# Altium schematic sheet Sheet_1.schdoc
size 604 x 406 mm
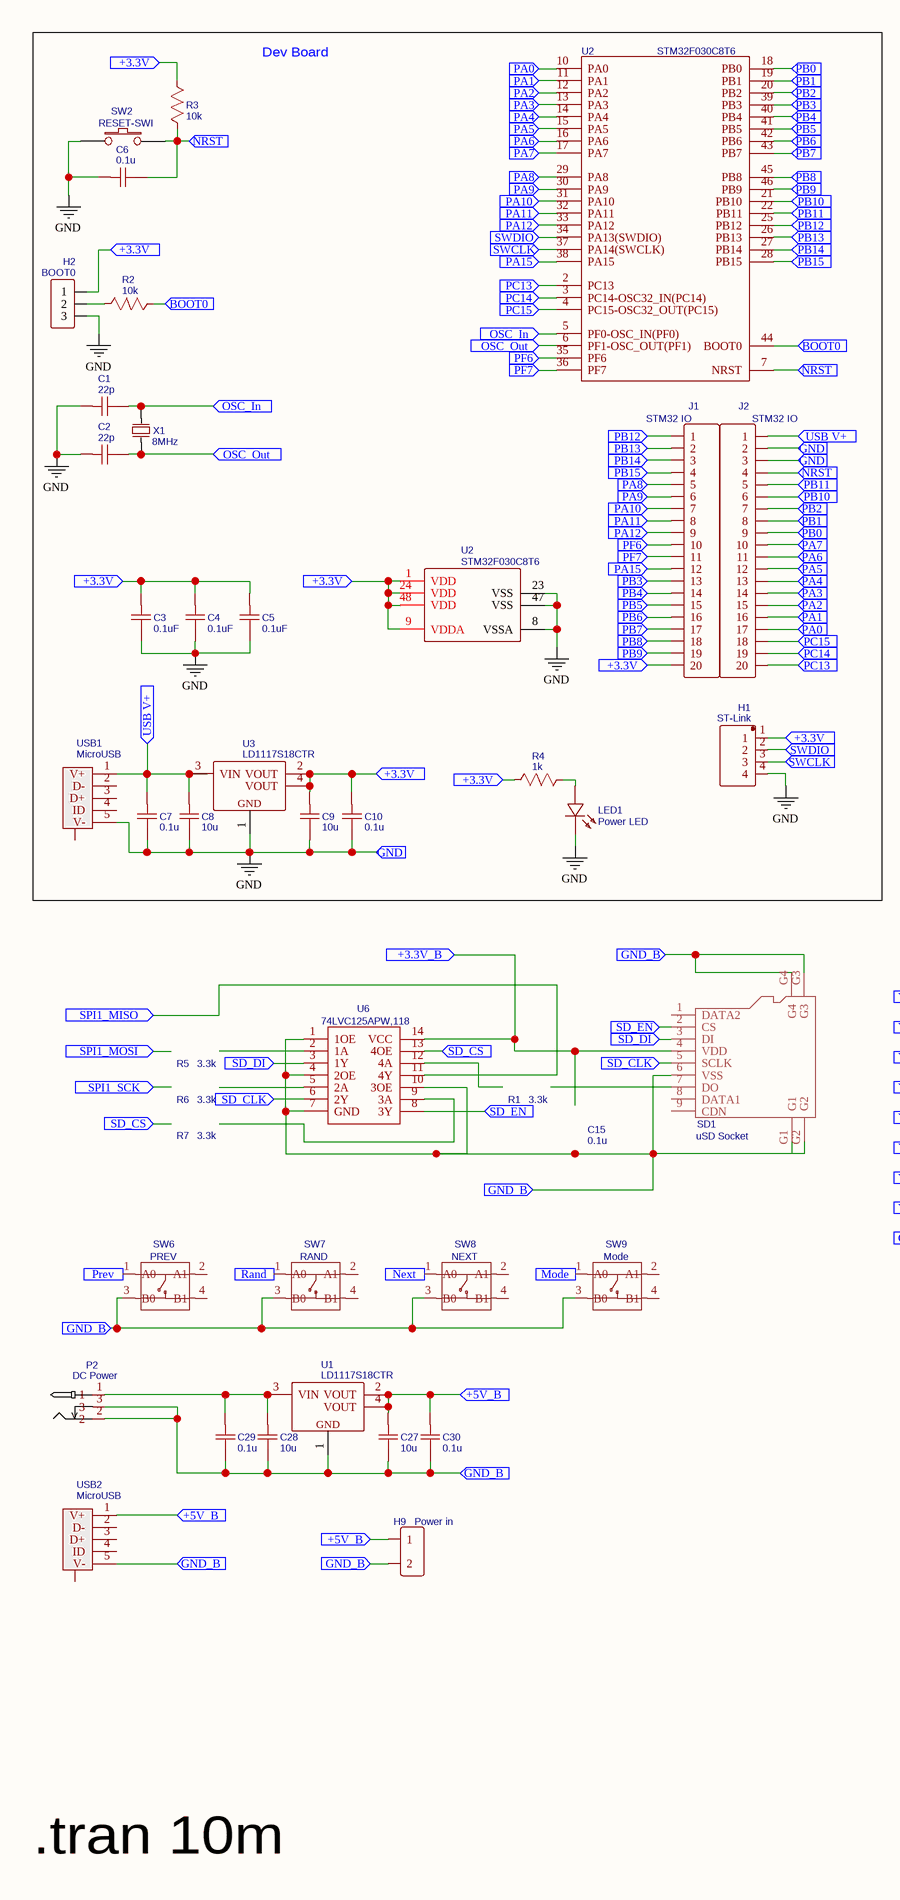
[diagram p0: Sheet_1.schdoc, left]
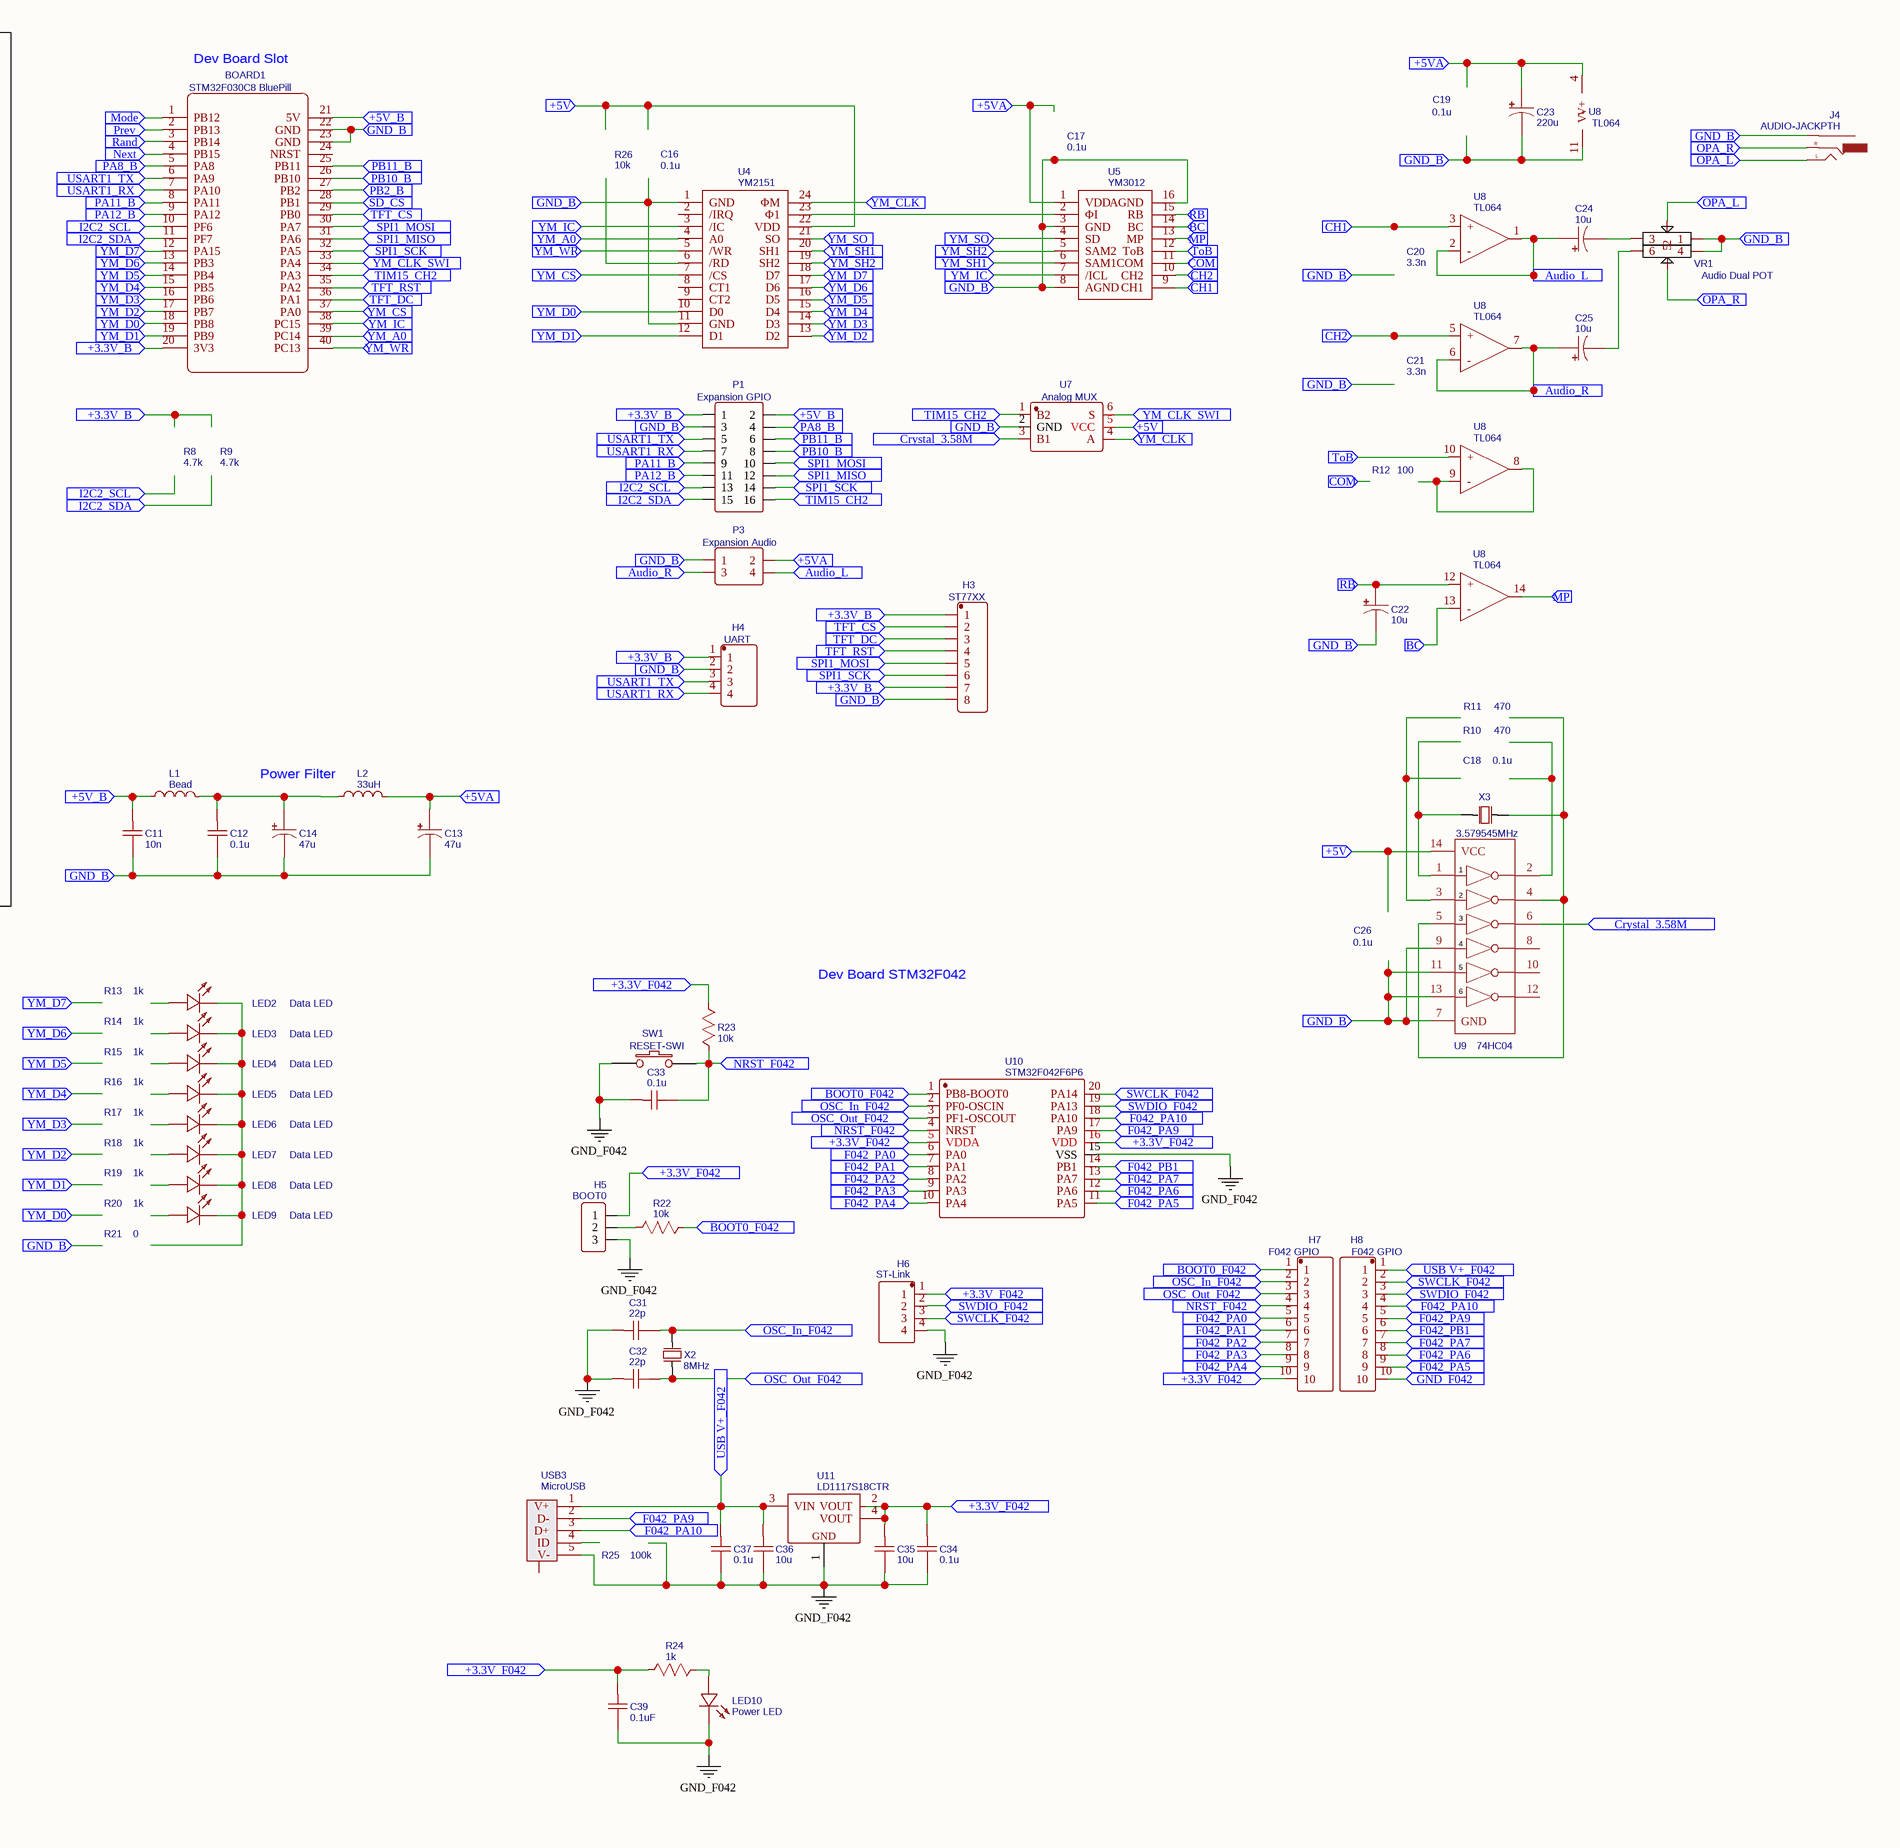
[diagram p1: Sheet_1.schdoc, right]

## Parts
(Parts that share a designator on the sheet are numbered #1, #2 ... from top to bottom, then left to right.)
BOARD1  STM32F030C8 BluePill  [STM32F030CX_BLUEPILL-40-2.54MM]
C1  22p  [C0805]
C2  22p  [C0805]
C3  0.1uF  [C0805]
C4  0.1uF  [C0805]
C5  0.1uF  [C0805]
C6  0.1u  [C0805]
C7  0.1u  [C0805]
C8  10u  [C0805]
C9  10u  [C0805]
C10  0.1u  [C0805]
C11  10n  [C0805]
C12  0.1u  [C0805]
C13  47u  [CAP-D4.0XH5.5]
C14  47u  [CAP-D4.0XH5.5]
C15  0.1u  [0805]
C16  0.1u  [0805]
C17  0.1u  [0805]
C18  0.1u  [0805]
C19  0.1u  [0805]
C20  3.3n  [0805]
C21  3.3n  [0805]
C22  10u  [CAP-D4.0XH5.5]
C23  220u  [CAP-D5.0XH5.5]
C24  10u  [CAP-D5.0XH5.5]
C25  10u  [CAP-D5.0XH5.5]
C26  0.1u  [0805]
C27  10u  [C0805]
C28  10u  [C0805]
C29  0.1u  [C0805]
C30  0.1u  [C0805]
C31  22p  [C0805]
C32  22p  [C0805]
C33  0.1u  [C0805]
C34  0.1u  [C0805]
C35  10u  [C0805]
C36  10u  [C0805]
C37  0.1u  [C0805]
C39  0.1uF  [C0805]
H1  ST-Link  [DIP-1X4P-2.54MM-M]
H2  BOOT0  [HDR-TH_3P-P2.54-V]
H3  ST77XX  [210S-1X8P]
H4  UART  [DIP-1X4P-2.54MM-M]
H5  BOOT0  [HDR-TH_3P-P2.54-V]
H6  ST-Link  [DIP-1X4P-2.54MM-M]
H7  F042 GPIO  [210S-1X10P]
H8  F042 GPIO  [210S-1X10P]
H9  Power in  [HDR-2X1/2.54]
J1  STM32 IO  [HDR-TH_20PIN-V-MALE-PITCH2.54]
J2  STM32 IO  [HDR-TH_20PIN-V-MALE-PITCH2.54]
J4  AUDIO-JACKPTH  [AUDIO-JACK]
L1  Bead  [L1206]
L2  33uH  [IND-SMD_L7.5-W6.6]
LED1  Power LED  [LED-0805]
LED2  Data LED  [LED-0805]
LED3  Data LED  [LED-0805]
LED4  Data LED  [LED-0805]
LED5  Data LED  [LED-0805]
LED6  Data LED  [LED-0805]
LED7  Data LED  [LED-0805]
LED8  Data LED  [LED-0805]
LED9  Data LED  [LED-0805]
LED10  Power LED  [LED-0805]
P1  Expansion GPIO  [HDR-8X2/2.54]
P2  DC Power  [DC005-2.5MM]
P3  Expansion Audio  [HDR-TH_4PIN-V-ROW2-COL2-MALE-PITCH2.54]
R1  3.3k  [0805]
R2  10k  [R0805]
R3  10k  [R0805]
R4  1k  [R0805]
R5  3.3k  [0805]
R6  3.3k  [0805]
R7  3.3k  [0805]
R8  4.7k  [0805]
R9  4.7k  [0805]
R10  470  [0805]
R11  470  [0805]
R12  100  [0805]
R13  1k  [0805]
R14  1k  [0805]
R15  1k  [0805]
R16  1k  [0805]
R17  1k  [0805]
R18  1k  [0805]
R19  1k  [0805]
R20  1k  [0805]
R21  0  [0805]
R22  10k  [R0805]
R23  10k  [R0805]
R24  1k  [R0805]
R25  100k  [0805]
R26  10k  [0805]
SD1  uSD Socket  [MICRO-SD9+4P-SMD-16.1X14.5X1.85MM]
SW1  RESET-SWI  [SWITCH-3X6X2.5_SMD]
SW2  RESET-SWI  [SWITCH-3X6X2.5_SMD]
SW6  PREV  [SW4-SMD-4.5-6.0X6.0X7.5MM]
SW7  RAND  [SW4-SMD-4.5-6.0X6.0X7.5MM]
SW8  NEXT  [SW4-SMD-4.5-6.0X6.0X7.5MM]
SW9  Mode  [SW4-SMD-4.5-6.0X6.0X7.5MM]
U1  LD1117S18CTR  [SOT-223]
U2#1  STM32F030C8T6  [STM-LQFP48]
U2#2  STM32F030C8T6  [STM-LQFP48]
U3  LD1117S18CTR  [SOT-223]
U4  YM2151  [DIP-24_24PIN-LS15.24-L31.00-W13.00-PITCH2.54]
U5  YM3012  [DIP-16_L20.0-W6.4-P2.54-LS7.6-BL]
U6  74LVC125APW,118  [TSSOP-14]
U7  Analog MUX  [SC-70-6(SOT-363)]
U8#1  TL064  [DIP-14_L20.0-W7.6-P2.54-LS7.6-BL]
U8#2  TL064  [DIP-14_L19.2-W6.6-P2.54-LS10.9-BL]
U8#3  TL064
U8#4  TL064
U8#5  TL064
U9  74HC04  [DIP14]
U10  STM32F042F6P6  [TSSOP-20]
U11  LD1117S18CTR  [SOT-223]
USB1  MicroUSB  [MICRO-USB-1]
USB2  MicroUSB  [MICRO-USB-1]
USB3  MicroUSB  [MICRO-USB-1]
VR1  Audio Dual POT  [POTENTIOMETER AUDIO DUAL]
X1  8MHz  [HC-49US_L11.5-W4.5-P4.88]
X2  8MHz  [HC-49US_L11.5-W4.5-P4.88]
X3  3.579545MHz  [HC-49US_L11.5-W4.5-P4.88]

## Blocks framed on the sheet
Dev Board: C1-C10 H1 H2 J1 J2 LED1 R2-R4 SW2 U2#1 U2#2 U3 USB1 X1

## Ports
+3.3V (in), +3.3V_B (in), +3.3V_F042 (in), +5V (in), +5V_B (in), +5VA (in), Audio_L (in), Audio_R (in), BC (in), BOOT0 (in), BOOT0_F042 (in), CH1 (in), CH2 (in), COM (in), Crystal_3.58M (in), F042_PA0 (in), F042_PA1 (in), F042_PA2 (in), F042_PA3 (in), F042_PA4 (in), F042_PA5 (in), F042_PA6 (in), F042_PA7 (in), F042_PA9 (in), F042_PA10 (in), F042_PB1 (in), GND (in), GND_B (in), GND_F042 (in), I2C2_SCL (in), I2C2_SDA (in), Mode (in), MP (in), Next (in), NRST (in), NRST_F042 (in), OPA_L (in), OPA_R (in), OSC_In (in), OSC_In_F042 (in), OSC_Out (in), OSC_Out_F042 (in), PA0 (in), PA1 (in), PA2 (in), PA3 (in), PA4 (in), PA5 (in), PA6 (in), PA7 (in), PA8 (in), PA8_B (in), PA9 (in), PA10 (in), PA11 (in), PA11_B (in), PA12 (in), PA12_B (in), PA15 (in), PB0 (in), PB1 (in), PB2 (in), PB2_B (in), PB3 (in), PB4 (in), PB5 (in), PB6 (in), PB7 (in), PB8 (in), PB9 (in), PB10 (in), PB10_B (in), PB11 (in), PB11_B (in), PB12 (in), PB13 (in), PB14 (in), PB15 (in), PC13 (in), PC14 (in), PC15 (in), PF6 (in), PF7 (in), Prev (in), Rand (in), RB (in), SD_CLK (in), SD_CS (in), SD_DI (in), SD_EN (in), SPI1_MISO (in), SPI1_MOSI (in), SPI1_SCK (in), SWCLK (in), SWCLK_F042 (in), SWDIO (in), SWDIO_F042 (in), TFT_CS (in), TFT_DC (in), TFT_RST (in), TIM15_CH2 (in), ToB (in), USART1_RX (in), USART1_TX (in), USB V+ (in), USB V+_F042 (in), YM_A0 (in), YM_CLK (in), YM_CLK_SWI (in), YM_CS (in), YM_D0 (in), YM_D1 (in), YM_D2 (in), YM_D3 (in), YM_D4 (in), YM_D5 (in), YM_D6 (in), YM_D7 (in), YM_IC (in), YM_SH1 (in), YM_SH2 (in), YM_SO (in), YM_WR (in)

## Nets
GND: C1.2 C2.2 C3.1 C4.1 C5.1 C6.2 C7.1 C8.1 C9.1 C10.1 H1.4 H2.3 J2.2 J2.3 LED1.2(K) SW2.1 U2#2.8(VSSA) U2#2.23(VSS) U2#2.47(VSS) U3.1(GND) USB1.5(V-) ; port GND
GND_F042: C31.2 C32.2 C33.2 C34.1 C35.1 C36.1 C37.1 C39.1 H5.3 H6.4 LED10.2(K) SW1.1 U10.15(VSS) U11.1(GND) USB3.5(V-)
+3.3V: C3.2 C4.2 C5.2 C9.2 C10.2 H1.1 H2.1 J1.20 R3.2 R4.2 U2#2.1(VDD) U2#2.9(VDDA) U2#2.24(VDD) U2#2.48(VDD) U3.2(VOUT) U3.4(VOUT) ; port +3.3V
+3.3V_B: BOARD1.20(3V3) H3.1 H3.7 H4.1 P1.1 SD1.4(VDD) U6.14(VCC) ; port +3.3V_B
+3.3V_F042: C34.2 C35.2 C39.2 H5.1 H6.1 H7.10 R23.2 R24.2 U10.5(VDDA) U10.16(VDD) U11.2(VOUT) U11.4(VOUT) ; port +3.3V_F042
+5V: U4.22(VDD) U7.5(VCC) U9.14(VCC) ; port +5V
+5V_B: BOARD1.21(5V) C11.2 C27.2 C30.2 H9.1 L1.1 P1.2 U1.2(VOUT) U1.4(VOUT) USB2.1(V+) ; port +5V_B
+5VA: C13.1 C23.1 L2.2 P3.2 U5.1(VDD) U8#1.4(V+) ; port +5VA
Audio_L: C24.1 P3.4 U8#2.1 U8#2.2(-) ; port Audio_L
Audio_R: C25.1 P3.3 U8#3.6(-) U8#3.7 ; port Audio_R
BC: U5.14(BC) U8#5.13(-) ; port BC
BOOT0: R2.2 U2#1.44(BOOT0) ; port BOOT0
BOOT0_F042: H7.1 R22.2 U10.1(PB8-BOOT0) ; port BOOT0_F042
CH1: U5.9(CH1) U8#2.3(+) ; port CH1
CH2: U5.10(CH2) U8#3.5(+) ; port CH2
COM: U5.11(COM) ; port COM
Crystal_3.58M: U7.3(B1) U9.6(3Y) ; port Crystal_3.58M
F042_PA0: H7.5 U10.6(PA0) ; port F042_PA0
F042_PA1: H7.6 U10.7(PA1) ; port F042_PA1
F042_PA2: H7.7 U10.8(PA2) ; port F042_PA2
F042_PA3: H7.8 U10.9(PA3) ; port F042_PA3
F042_PA4: H7.9 U10.10(PA4) ; port F042_PA4
F042_PA5: H8.9 U10.11(PA5) ; port F042_PA5
F042_PA6: H8.8 U10.12(PA6) ; port F042_PA6
F042_PA7: H8.7 U10.13(PA7) ; port F042_PA7
F042_PA9: H8.5 U10.17(PA9) USB3.2(D-) ; port F042_PA9
F042_PA10: H8.4 U10.18(PA10) USB3.3(D+) ; port F042_PA10
F042_PB1: H8.6 U10.14(PB1) ; port F042_PB1
GND_B: BOARD1.22(GND) BOARD1.23(GND) C11.1 C12.1 C13.2 C14.2 C22.2 C23.2 C27.1 C28.1 C29.1 C30.1 H3.8 H4.2 H9.2 J4.SLEEVE P1.3 P2.2 P2.3 P3.1 SD1.6(VSS) SD1.G1 SD1.G2 SD1.G3 SD1.G4 SW6.3(B0) SW7.3(B0) SW8.3(B0) SW9.3(B0) U1.1(GND) U4.1(GND) U4.11(GND) U5.3(GND) U5.8(AGND) U5.16(AGND) U6.1(1OE) U6.4(2OE) U6.7(GND) U6.10(3OE) U7.2(GND) U8#1.11(V-) U9.7(GND) U9.9(4A) U9.11(5A) U9.13(6A) USB2.5(V-) VR1.1 VR1.4 ; port GND_B
GND_F042: H8.10 ; port GND_F042  [a separate net that carries the same name]
I2C2_SCL: BOARD1.10(PF6) P1.13 ; port I2C2_SCL
I2C2_SDA: BOARD1.11(PF7) P1.15 ; port I2C2_SDA
Mode: BOARD1.1(PB12) SW9.1(A0) ; port Mode
MP: U5.13(MP) U8#5.14 ; port MP
Next: BOARD1.4(PB15) SW8.1(A0) ; port Next
NRST: C6.1 J2.4 R3.1 SW2.2 U2#1.7(NRST) ; port NRST
NRST_F042: C33.1 H7.4 R23.1 SW1.2 U10.4(NRST) ; port NRST_F042
OPA_L: J4.TIP(LEFT) VR1.2 ; port OPA_L
OPA_R: J4.RING(RIGHT) VR1.5 ; port OPA_R
OSC_In: C1.1 U2#1.5(PF0-OSC_IN(PF0)) X1.1(OSC1) ; port OSC_In
OSC_In_F042: C31.1 H7.2 U10.2(PF0-OSCIN) X2.1(OSC1) ; port OSC_In_F042
OSC_Out: C2.1 U2#1.6(PF1-OSC_OUT(PF1)) X1.2(OSC2) ; port OSC_Out
OSC_Out_F042: C32.1 H7.3 U10.3(PF1-OSCOUT) X2.2(OSC2) ; port OSC_Out_F042
PA0: J2.17 U2#1.10(PA0) ; port PA0
PA1: J2.16 U2#1.11(PA1) ; port PA1
PA2: J2.15 U2#1.12(PA2) ; port PA2
PA3: J2.14 U2#1.13(PA3) ; port PA3
PA4: J2.13 U2#1.14(PA4) ; port PA4
PA5: J2.12 U2#1.15(PA5) ; port PA5
PA6: J2.11 U2#1.16(PA6) ; port PA6
PA7: J2.10 U2#1.17(PA7) ; port PA7
PA8: J1.5 U2#1.29(PA8) ; port PA8
PA8_B: BOARD1.5(PA8) P1.4 ; port PA8_B
PA9: J1.6 U2#1.30(PA9) ; port PA9
PA10: J1.7 U2#1.31(PA10) ; port PA10
PA11: J1.8 U2#1.32(PA11) ; port PA11
PA11_B: BOARD1.8(PA11) P1.9 ; port PA11_B
PA12: J1.9 U2#1.33(PA12) ; port PA12
PA12_B: BOARD1.9(PA12) P1.11 ; port PA12_B
PA15: J1.12 U2#1.38(PA15) ; port PA15
PB0: J2.9 U2#1.18(PB0) ; port PB0
PB1: J2.8 U2#1.19(PB1) ; port PB1
PB2: J2.7 U2#1.20(PB2) ; port PB2
PB2_B: BOARD1.27(PB2) ; port PB2_B
PB3: J1.13 U2#1.39(PB3) ; port PB3
PB4: J1.14 U2#1.40(PB4) ; port PB4
PB5: J1.15 U2#1.41(PB5) ; port PB5
PB6: J1.16 U2#1.42(PB6) ; port PB6
PB7: J1.17 U2#1.43(PB7) ; port PB7
PB8: J1.18 U2#1.45(PB8) ; port PB8
PB9: J1.19 U2#1.46(PB9) ; port PB9
PB10: J2.6 U2#1.21(PB10) ; port PB10
PB10_B: BOARD1.26(PB10) P1.8 ; port PB10_B
PB11: J2.5 U2#1.22(PB11) ; port PB11
PB11_B: BOARD1.25(PB11) P1.6 ; port PB11_B
PB12: J1.1 U2#1.25(PB12) ; port PB12
PB13: J1.2 U2#1.26(PB13) ; port PB13
PB14: J1.3 U2#1.27(PB14) ; port PB14
PB15: J1.4 U2#1.28(PB15) ; port PB15
PC13: J2.20 U2#1.2(PC13) ; port PC13
PC14: J2.19 U2#1.3(PC14-OSC32_IN(PC14)) ; port PC14
PC15: J2.18 U2#1.4(PC15-OSC32_OUT(PC15)) ; port PC15
PF6: J1.10 U2#1.35(PF6) ; port PF6
PF7: J1.11 U2#1.36(PF7) ; port PF7
Prev: BOARD1.2(PB13) SW6.1(A0) ; port Prev
Rand: BOARD1.3(PB14) SW7.1(A0) ; port Rand
RB: C22.1 U5.15(RB) U8#5.12(+) ; port RB
SD_CLK: SD1.5(SCLK) U6.6(2Y) ; port SD_CLK
SD_CS: BOARD1.28(PB1) U6.13(4OE) ; port SD_CS
SD_DI: SD1.3(DI) U6.3(1Y) ; port SD_DI
SD_EN: SD1.2(CS) U6.8(3Y) ; port SD_EN
SPI1_MISO: BOARD1.31(PA6) P1.12 U6.11(4Y) ; port SPI1_MISO
SPI1_MOSI: BOARD1.30(PA7) H3.5 P1.10 ; port SPI1_MOSI
SPI1_SCK: BOARD1.32(PA5) H3.6 P1.14 ; port SPI1_SCK
SWCLK: H1.3 U2#1.37(PA14(SWCLK)) ; port SWCLK
SWCLK_F042: H6.3 H8.2 U10.20(PA14) ; port SWCLK_F042
SWDIO: H1.2 U2#1.34(PA13(SWDIO)) ; port SWDIO
SWDIO_F042: H6.2 H8.3 U10.19(PA13) ; port SWDIO_F042
TFT_CS: BOARD1.29(PB0) H3.2 ; port TFT_CS
TFT_DC: BOARD1.36(PA1) H3.3 ; port TFT_DC
TFT_RST: BOARD1.35(PA2) H3.4 ; port TFT_RST
TIM15_CH2: BOARD1.34(PA3) P1.16 U7.1(B2) ; port TIM15_CH2
ToB: U5.12(ToB) U8#4.10(+) ; port ToB
USART1_RX: BOARD1.7(PA10) H4.4 P1.7 ; port USART1_RX
USART1_TX: BOARD1.6(PA9) H4.3 P1.5 ; port USART1_TX
USB V+: C7.2 C8.2 J2.1 U3.3(VIN) USB1.1(V+) ; port USB V+
USB V+_F042: C36.2 C37.2 H8.1 U11.3(VIN) USB3.1(V+) ; port USB V+_F042
YM_A0: BOARD1.39(PC14) U4.4(A0) ; port YM_A0
YM_CLK: U4.24(ΦM) U7.4(A) ; port YM_CLK
YM_CLK_SWI: BOARD1.33(PA4) U7.6(S) ; port YM_CLK_SWI
YM_CS: BOARD1.37(PA0) U4.7(/CS) ; port YM_CS
YM_D0: BOARD1.18(PB8) U4.10(D0) ; port YM_D0
YM_D1: BOARD1.19(PB9) U4.12(D1) ; port YM_D1
YM_D2: BOARD1.17(PB7) U4.13(D2) ; port YM_D2
YM_D3: BOARD1.16(PB6) U4.14(D3) ; port YM_D3
YM_D4: BOARD1.15(PB5) U4.15(D4) ; port YM_D4
YM_D5: BOARD1.14(PB4) U4.16(D5) ; port YM_D5
YM_D6: BOARD1.13(PB3) U4.17(D6) ; port YM_D6
YM_D7: BOARD1.12(PA15) U4.18(D7) ; port YM_D7
YM_IC: BOARD1.38(PC15) U4.3(/IC) U5.7(/ICL) ; port YM_IC
YM_SH1: U4.20(SH1) U5.6(SAM1) ; port YM_SH1
YM_SH2: U4.19(SH2) U5.5(SAM2) ; port YM_SH2
YM_SO: U4.21(SO) U5.4(SD) ; port YM_SO
YM_WR: BOARD1.40(PC13) U4.5(/WR) ; port YM_WR
NetC12_2: C12.2 C14.1 L1.2 L2.1
NetC24_2: C24.2 VR1.3
NetC25_2: C25.2 VR1.6
NetC28_2: C28.2 C29.2 P2.1 U1.3(VIN)
NetH2_2: H2.2 R2.1
NetH5_2: H5.2 R22.1
NetLED1_1: LED1.1(A) R4.1
NetLED2_2: LED2.2(K) LED3.2(K) LED4.2(K) LED5.2(K) LED6.2(K) LED7.2(K) LED8.2(K) LED9.2(K)
NetLED10_1: LED10.1(A) R24.1
NetU4_23: U4.23(Φ1) U5.2(ΦI)
NetU8#4_8: U8#4.8 U8#4.9(-)
NetU9_1: U9.1(1A) X3.2(OSC2)
NetU9_4: U9.4(2Y) U9.5(3A) X3.1(OSC1)

Not connected (* = marked no-connect by the designer): BOARD1 24(NRST); LED2 1(A); LED3 1(A); LED4 1(A); LED5 1(A); LED6 1(A); LED7 1(A); LED8 1(A); LED9 1(A); SD1 1(DATA2) 7(DO) 8(DATA1) 9(CDN); SW6 2(A1) 4(B1); SW7 2(A1) 4(B1); SW8 2(A1) 4(B1); SW9 2(A1) 4(B1); U4 2(/IRQ) 6(/RD) 8(CT1) 9(CT2); U6 2(1A) 5(2A) 9(3A) 12(4A); U9 2(1Y) 3(2A) 8(4Y) 10(5Y) 12(6Y); USB1 0(MTN) 2(D-) 3(D+) 4(ID); USB2 0(MTN) 2(D-) 3(D+) 4(ID); USB3 0(MTN) 4(ID)

## Notes on the sheet
- Dev Board Slot
- (near L2) Power Filter
- Dev Board STM32F042
- .tran 10m
- (in symbol AUDIO-JACKPTH) R; L

## Library data of the parts
BOARD1 = STM32F030C8 BluePill: Contributor: Happeneddr9; BOM_Supplier: Me; spicePre: B; spiceSymbolName: STM32F030C8 BluePill
C1 C2 C31 C32 = 22p: nameAlias: Value(F); spicePre: C; spiceSymbolName: Cap_1206_US
C3-C5 C39 = 0.1uF: nameAlias: Value(F); spicePre: C; spiceSymbolName: Cap_1206_US
C6 C7 C10 C12 C15-C19 C26 C29 C30 C33 C34 C37 = 0.1u: nameAlias: Value(F); spicePre: C
  C6 C7 C10 C12 C29 C30 C33 C34 C37: spiceSymbolName: Cap_1206_US
  C15-C19 C26: spiceSymbolName: Cap_0805_US
C8 C9 C22 C24 C25 C27 C28 C35 C36 = 10u: nameAlias: Value(F); spicePre: C
  C8 C9 C27 C28 C35 C36: spiceSymbolName: Cap_1206_US
  C22: spiceSymbolName: Cap_Electrolytic(SMD)_D4.0XH5.5_US
  C24 C25: spiceSymbolName: Cap_Electrolytic(SMD)_D5.0XH5.5_US
C11 = 10n: nameAlias: Value(F); spicePre: C; spiceSymbolName: Cap_1206_US
C13 C14 = 47u: nameAlias: Value(F); spicePre: C; spiceSymbolName: Cap_Electrolytic(SMD)_D4.0XH5.5_US
C20 C21 = 3.3n: nameAlias: Value(F); spicePre: C; spiceSymbolName: Cap_0805_US
C23 = 220u: nameAlias: Value(F); spicePre: C; spiceSymbolName: Cap_Electrolytic(SMD)_D5.0XH5.5_US
H1 H6 = ST-Link: BOM_Manufacturer: Ckmtw; BOM_Manufacturer Part: 210S-1*4P L=11.6MMGold-plated black; Contributor: LCSC; BOM_Supplier: LCSC; BOM_Supplier Part: C124378; spicePre: H; spiceSymbolName: Header-Male-2.54_1x4
H2 H5 = BOOT0: BOM_Manufacturer: BOOMELE; BOM_Manufacturer Part: Header2.54mm 1*3P; BOM_Supplier: LCSC; image: //image.lceda.cn/szlcsc/C49257.jpg; BOM_Supplier Part: C49257; spicePre: H; spiceSymbolName: Header-Male-2.54_1x3
H3 = ST77XX: BOM_Manufacturer: Ckmtw; BOM_Manufacturer Part: 210S-1*8P L=11.6MMGold-plated black; Contributor: LCSC; BOM_Supplier: LCSC; BOM_Supplier Part: C124381; spicePre: H; spiceSymbolName: Header-Male-2.54_1x8
H4 = UART: BOM_Manufacturer: Ckmtw; BOM_Manufacturer Part: 210S-1*4P L=11.6MMGold-plated black; Contributor: LCSC; BOM_Supplier: LCSC; BOM_Supplier Part: C124378; spicePre: H; spiceSymbolName: Header-Male-2.54_1x4
H7 H8 = F042 GPIO: BOM_Manufacturer: Ckmtw; BOM_Manufacturer Part: 210S-1*10P L=11.6MMGold-plated black; Contributor: LCSC; BOM_Supplier: LCSC; BOM_Supplier Part: C124372; spicePre: H; spiceSymbolName: 210S-1*10P L=11.6MMGold-plated black
H9 = Power in: BOM_Manufacturer: TE Connectivity; BOM_Manufacturer Part: 826629-2; BOM_Supplier: LCSC; image: //image.lceda.cn/szlcsc/C86471.jpg; BOM_Supplier Part: C86471; spicePre: H; spiceSymbolName: Header-Male-2.54_1x2
J1 J2 = STM32 IO: BOM_Manufacturer: BOOMELE; BOM_Manufacturer Part: 2.54mm 1*20PHeader; BOM_Supplier: LCSC; image: //image.lceda.cn/szlcsc/C50981.jpg; BOM_Supplier Part: C50981; spicePre: J; spiceSymbolName: Header-Male-2.54_1x20
J4 = AUDIO-JACKPTH: description: 3.5mm Audio Jack; timeStamp: 1464432393; spicePre: J; spiceSymbolName: AUDIO-JACKPTH
L1 = Bead: BOM_Manufacturer: Fair Rite; BOM_Manufacturer Part: 2512066017Y1; Contributor: michael murillo; spicePre: L; spiceSymbolName: Bead
L2 = 33uH: BOM_Manufacturer: GLE; BOM_Manufacturer Part: GCDA0630-330MC; nameAlias: Inductance; Contributor: LCSC; BOM_Supplier: LCSC; BOM_Supplier Part: C439280; spicePre: L; spiceSymbolName: GCDA0630-330MC
LED1 LED10 = Power LED: BOM_Manufacturer: EVERLIGHT; BOM_Manufacturer Part: 17-21SURC/S530-A2/TR8; Contributor: LCSC; BOM_Supplier: LCSC; BOM_Supplier Part: C131244; spicePre: L; spiceSymbolName: 17-21SURC/S530-A2/TR8
LED2-LED9 = Data LED: BOM_Manufacturer: EVERLIGHT; BOM_Manufacturer Part: 17-21SURC/S530-A2/TR8; Contributor: LCSC; BOM_Supplier: LCSC; BOM_Supplier Part: C131244; spicePre: L; spiceSymbolName: 17-21SURC/S530-A2/TR8
P1 = Expansion GPIO: BOM_Manufacturer: BOOMELE; BOM_Manufacturer Part: Double row straight 2*8Headers  Pins 2.54mm; BOM_Supplier: LCSC; image: //image.lceda.cn/szlcsc/C68234.jpg; BOM_Supplier Part: C68234; spicePre: P; spiceSymbolName: Header-Male-2.54_2x8
P2 = DC Power: BOM_Manufacturer: ReliaPro; BOM_Manufacturer Part: Three-pin power interface DC005 2.5MMsocket Bagged RHOS; BOM_Supplier Part: undefined; BOM_Supplier: LCSC; image: http://image.lceda.cn/szlcsc/C68942.jpg; spicePre: P; spiceSymbolName: Three-pin power interface DC005 2.5MMsocket Bagged RHOS
P3 = Expansion Audio: BOM_Manufacturer: BOOMELE; BOM_Manufacturer Part: Double Rows2.54mm2*2pHeaders  Pins; BOM_Supplier: LCSC; BOM_Supplier Part: C66690; spicePre: P; spiceSymbolName: Header-Male-2.54_2x2
R1 R5-R7 = 3.3k: nameAlias: Value(Ω); spicePre: R; spiceSymbolName: Res_0805(1/8W)_US
R2 R3 R22 R23 R26 = 10k: nameAlias: Value(Ω); spicePre: R
  R2 R3 R22 R23: spiceSymbolName: Res_1206(1/4W)_US
  R26: spiceSymbolName: Res_0805(1/8W)_US
R4 R13-R20 R24 = 1k: nameAlias: Value(Ω); spicePre: R
  R4 R24: spiceSymbolName: Res_1206(1/4W)_US
  R13-R20: spiceSymbolName: Res_0805(1/8W)_US
R8 R9 = 4.7k: nameAlias: Value(Ω); spicePre: R; spiceSymbolName: Res_0805(1/8W)_US
R10 R11 = 470: nameAlias: Value(Ω); spicePre: R; spiceSymbolName: Res_0805(1/8W)_US
R12 = 100: nameAlias: Value(Ω); spicePre: R; spiceSymbolName: Res_0805(1/8W)_US
R21 = 0: nameAlias: Value(Ω); spicePre: R; spiceSymbolName: Res_0805(1/8W)_US
R25 = 100k: nameAlias: Value(Ω); spicePre: R; spiceSymbolName: Res_0805(1/8W)_US
SD1 = uSD Socket: Contributor: Felix Fricke; spicePre: S; spiceSymbolName: MICRO-SD-CARD-SOCKET-9P(ST-TF-003A)
SW1 SW2 = RESET-SWI: BOM_Manufacturer: BBJ; BOM_EasyEDA: E71857; BOM_Supplier Part: E71857; BOM_Supplier: EasyEDA; BOM_Manufacturer Part: SWITCH-3x6x2.5_SMD; spicePre: S; spiceSymbolName: SWITCH-3x6x2.5_SMD
U1 U3 U11 = LD1117S18CTR: description: Fixed Low Drop Positive Voltage Regulator, 1.8V, 4-Pin SOT-223, Tape and Reel; spicePre: U; spiceSymbolName: LD1117S18CTR
U2#1 U2#2 = STM32F030C8T6: subpart_no: 1; description: ARM Cortex-M0 32-bit MCU, 64 KB Flash, 8 KB Internal RAM, 39 IOs, 48-pin LQFP, -40 to 85 degC, Tray; spicePre: U; spiceSymbolName: STM32F030C8T6
U4 = YM2151: Contributor: Happeneddr9; BOM_Supplier: Me; spicePre: U; spiceSymbolName: YM2151
U5 = YM3012: Contributor: Happeneddr9; BOM_Supplier: Me; spicePre: U; spiceSymbolName: YM3012
U6 = 74LVC125APW,118: BOM_Manufacturer: Nexperia; Contributor: jobsonp; BOM_Supplier Part: C6059; BOM_Supplier: LCSC; BOM_Manufacturer Part: 74LVC125APW,118; image: //image.lceda.cn/szlcsc/C6059.jpg; spicePre: U; spiceSymbolName: 74LVC125APW,118
U7 = Analog MUX: BOM_Manufacturer: TI; BOM_Manufacturer Part: SN74LVC1G3157DCKR; SMT Type: Extend; spicePre: X; BOM_Supplier: LCSC; image: //image.lceda.cn/szlcsc/C38663.jpg; BOM_Supplier Part: C38663; BOM_LCSC Assembly: Yes; spiceSymbolName: SN74LVC1G3157DCKR (SPDT)
U8#1-U8#5 = TL064: subpart_no: 1; Contributor: Bikebreaker; spicePre: U; spiceSymbolName: TL064
U9 = 74HC04: description: 74HC04 Hex Inverter; Contributor: SparkFun; spicePre: U; spiceSymbolName: 74HC04_HEX_INVERTER
U10 = STM32F042F6P6: BOM_Manufacturer: STMicroelectronics; BOM_Supplier Part: C81000; BOM_Supplier: LCSC; BOM_Manufacturer Part: STM32F042F6P6; spicePre: U; spiceSymbolName: STM32F042F6P6
USB1-USB3 = MicroUSB: BOM_Manufacturer: ValuePro; BOM_Manufacturer Part: micro USBFemale; BOM_Supplier: LCSC; image: //image.lceda.cn/szlcsc/C10418.jpg; BOM_Supplier Part: C10418; spicePre: U; spiceSymbolName: micro USBFemale++
VR1 = Audio Dual POT: BOM_Manufacturer Part: Audio Dual Gang Potensiometer; Contributor: Lumilun; spicePre: U; spiceSymbolName: Audio Dual Gang Potensiometer
X1 X2 = 8MHz: BOM_Manufacturer: YXC; BOM_Manufacturer Part: X49SD12MSD2SC; nameAlias: Frequency; BOM_Supplier: LCSC; BOM_Supplier Part: C16369; spicePre: X; spiceSymbolName: X49SD12MSD2SC
X3 = 3.579545MHz: BOM_Manufacturer: YXC; BOM_Manufacturer Part: X49SD12MSD2SC; nameAlias: Frequency; BOM_Supplier: LCSC; BOM_Supplier Part: C16369; spicePre: X; spiceSymbolName: X49SD12MSD2SC
SW6 = PREV: BOM_Manufacturer Part: ?; spicePre: S; spiceSymbolName: SMD-BUTTON(4P-6.0X6.0X7.5MM)
SW7 = RAND: BOM_Manufacturer Part: ?; spicePre: S; spiceSymbolName: SMD-BUTTON(4P-6.0X6.0X7.5MM)
SW8 = NEXT: BOM_Manufacturer Part: ?; spicePre: S; spiceSymbolName: SMD-BUTTON(4P-6.0X6.0X7.5MM)
SW9 = Mode: BOM_Manufacturer Part: ?; spicePre: S; spiceSymbolName: SMD-BUTTON(4P-6.0X6.0X7.5MM)